# EAGLE design z0-probe-v8 (EAGLE 9.4.1)
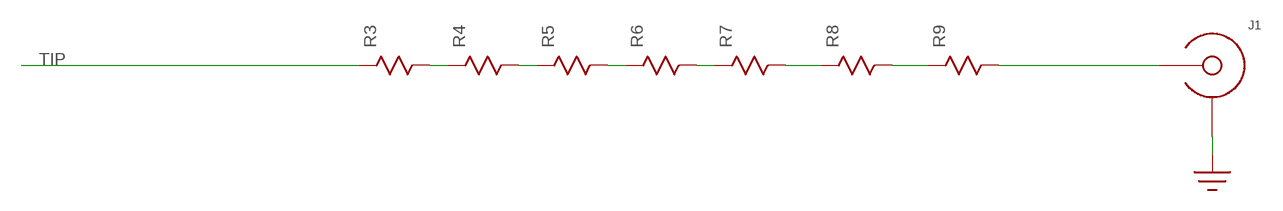
[diagram p0: schematic, sheet 1]

## Parts
J1  SMA-EDGE-LAUNCH  [SMA_EDGE_LAUNCH_2L_4020_TAPER_FIXED]
R3  R0603-TIGHT  [0603_TIGHT]
R4  R0603-TIGHT  [0603_TIGHT]
R5  R0603-TIGHT  [0603_TIGHT]
R6  R0603-TIGHT  [0603_TIGHT]
R7  R0603-TIGHT  [0603_TIGHT]
R8  R0603-TIGHT  [0603_TIGHT]
R9  R0603-TIGHT  [0603_TIGHT]

## Nets
GND: J1.BOTTOM_GND(SHIELD) J1.GND@1(SHIELD) J1.GND@2(SHIELD) J1.GND@3(SHIELD) J1.GND@4(SHIELD) J1.GND@5(SHIELD) J1.GND@6(SHIELD) J1.GND@7(SHIELD) J1.GND@8(SHIELD) J1.GND@14(SHIELD) J1.GND@15(SHIELD) J1.GND@16(SHIELD) J1.GND@17(SHIELD) J1.GND_PAD1(SHIELD) J1.GND_PAD2(SHIELD) J1.P$1(SHIELD) J1.P$2(SHIELD)
N$3: R3.P$2 R4.P$1
N$4: R4.P$2 R5.P$1
N$5: R5.P$2 R6.P$1
N$6: R6.P$2 R7.P$1
N$7: R7.P$2 R8.P$1
N$8: R8.P$2 R9.P$1
N$9 [50-ohm]: J1.CENTER@1(CENTER) J1.P$3(CENTER) R9.P$2
TIP: R3.P$1

## Library data of the parts
J1 = sma_footprint_2l:SMA-EDGE-LAUNCH
R3-R9 = yapo:R

## Net classes
1 50-ohm: width 0.775 mm, clearance 0.152 mm

## Board
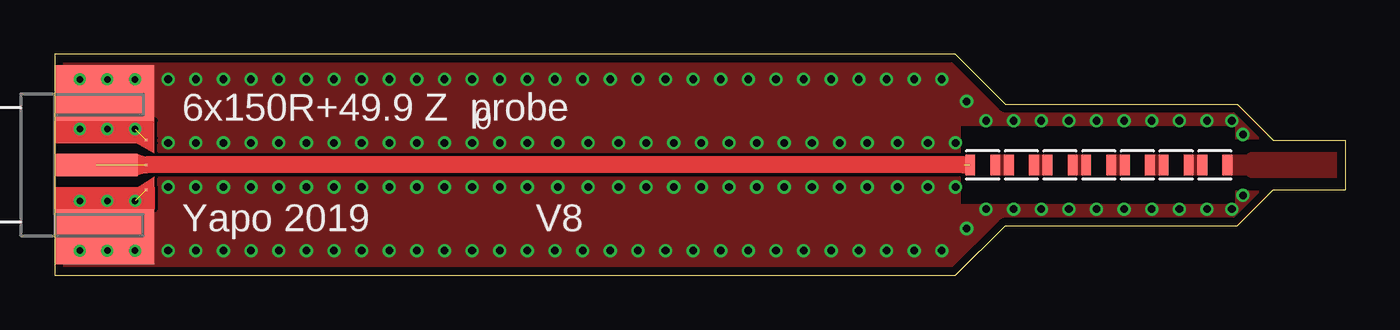
[diagram p1: board, top side]
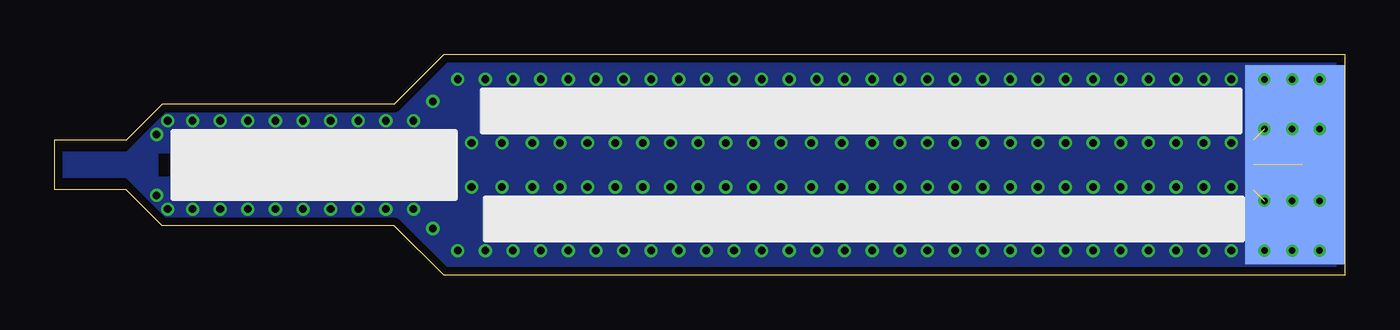
[diagram p2: board, bottom side, seen from below]

Size 59.31 x 10.16 mm. Coordinates in mm from the lower left corner, seen from the top.
Outline: 0,0 41.4,0 43.69,2.29 54.36,2.29 56.01,3.94 59.31,3.94 59.31,6.22 56.01,6.22 54.36,7.87 43.69,7.87 41.4,10.16 0,10.16 0,0
Copper layers (1*16): Top 0.035559375mm / dielectric 1.6mm / Bottom 0.035559375mm
Design rules "oshpark-2layer *": minimum track width 6mil, minimum drill 10mil, track to track 6mil, track to pad 6mil, pad to pad 6mil, via to via 6mil, smd to smd 6mil, copper to edge 15mil, drill to drill 6mil, minimum pad ring 5mil, minimum via ring 5mil, stop-mask expansion 2.5mil, vias tented up to drill 20mil, thermal gap 10mil

### Footprints (pad centres in the part's own frame; a part is rotated, then mirrored left to right if it is on the bottom)
SMA_EDGE_LAUNCH_2L_4020_TAPER_FIXED = smd 4.572 x 9.144 bottom: BOTTOM_GND 2.286,0 | smd 3.81 x 1.016: CENTER@1 1.905,0 | drill 0.3: GND@1 1.143,3.937; GND@2 3.683,3.937; GND@3 1.143,1.651; GND@4 3.683,1.651; GND@5 1.143,-1.651; GND@6 3.683,-1.651; GND@7 1.143,-3.937; GND@8 3.683,-3.937; GND@14 2.413,3.937; GND@15 2.413,-3.937; GND@16 2.413,-1.651; GND@17 2.413,1.651 | smd 4.572 x 2.54: GND_PAD1 2.286,3.302; GND_PAD2 2.286,-3.302 | smd 0.127 x 0.127: P$1 4.191,1.143; P$2 4.191,-1.143; P$3 4.191,0
0603_TIGHT = smd 0.45 x 0.95: P$1 -0.575,0; P$2 0.575,0

### Placement (x,y rotation side)
J1  0,5.08 0 top
R3  53.31,5.08 180 top
R4  51.54,5.08 180 top
R5  49.76,5.08 180 top
R6  47.98,5.08 180 top
R7  46.2,5.08 180 top
R8  44.42,5.08 180 top
R9  42.65,5.08 180 top

### Tracks (layer width: path | path; a pad name or v marks a point on that pad's centre or on a via)
GND  (via drill 0.35)  (2 unrouted)
  other vias: 42.8,7.11 44.07,7.11 45.34,7.11 46.61,7.11 47.88,7.11 49.15,7.11 50.42,7.11 51.69,7.11 52.96,7.11 54.1,7.11 42.8,3.05 44.07,3.05 45.34,3.05 46.61,3.05 47.88,3.05 49.15,3.05 50.42,3.05 51.69,3.05 52.96,3.05 54.1,3.05 41.91,8 41.91,2.16 54.61,6.48 54.61,3.68 11.56,6.1 12.83,6.1 14.1,6.1 15.37,6.1 16.64,6.1 17.91,6.1 19.18,6.1 20.45,6.1 21.72,6.1 23.11,6.1 24.51,6.1 25.91,6.1 38.73,6.1 40.13,6.1 11.56,4.06 12.83,4.06 14.1,4.06 15.37,4.06 16.64,4.06 17.91,4.06 19.18,4.06 20.45,4.06 21.72,4.06 23.11,4.06 24.51,4.06 25.91,4.06 38.73,4.06 40.13,4.06 11.56,9.02 12.83,9.02 14.1,9.02 15.37,9.02 16.64,9.02 17.91,9.02 19.18,9.02 20.45,9.02 21.72,9.02 22.99,9.02 24.26,9.02 25.53,9.02 26.8,9.02 39.5,9.02 40.77,9.02 11.56,1.14 12.83,1.14 14.1,1.14 15.37,1.14 16.64,1.14 17.91,1.14 19.18,1.14 20.45,1.14 21.72,1.14 22.99,1.14 24.26,1.14 25.53,1.14 26.8,1.14 39.5,1.14 40.77,1.14 5.21,6.1 6.48,6.1 7.75,6.1 9.02,6.1 10.29,6.1 5.21,9.02 6.48,9.02 7.75,9.02 9.02,9.02 10.29,9.02 5.21,1.14 6.48,1.14 7.75,1.14 9.02,1.14 10.29,1.14 5.21,4.06 6.48,4.06 7.75,4.06 9.02,4.06 10.29,4.06 41.4,6.1 41.4,4.06 28.07,9.02 29.34,9.02 30.61,9.02 31.88,9.02 33.15,9.02 34.42,9.02 35.69,9.02 36.96,9.02 38.23,9.02 27.18,6.1 28.45,6.1 29.72,6.1 30.99,6.1 32.26,6.1 33.53,6.1 34.8,6.1 36.07,6.1 37.34,6.1 27.18,4.06 28.45,4.06 29.72,4.06 30.99,4.06 32.26,4.06 33.53,4.06 34.8,4.06 36.07,4.06 37.34,4.06 28.07,1.14 29.34,1.14 30.61,1.14 31.88,1.14 33.15,1.14 34.42,1.14 35.69,1.14 36.96,1.14 38.23,1.14
  pour Top (isolate 0.152, rank 2, no thermals): 0,10.16 59.31,10.16 59.31,0 0,0
  pour Bottom: 0,0 59.31,0 59.31,10.16 0,10.16
  cutout Top: 41.66,6.83 41.66,5.61 54.23,5.61 54.23,6.83
  cutout Top: 54.23,5.71 59.31,5.71 59.31,6.22 54.23,6.22
  cutout Top: 54.23,4.45 54.23,3.94 59.31,3.94 59.31,4.45
  cutout Top: 41.66,4.55 41.66,3.33 54.23,3.33 54.23,4.55
  cutout Bottom: 54.48,5.59 41.78,5.59 41.78,4.57 54.48,4.57
  cutout Bottom: 55.5,6.22 56.01,5.71 59.31,5.71 59.31,6.22
  cutout Bottom: 55.5,3.94 56.01,4.45 59.31,4.45 59.31,3.94
N$3
  pour Top (no thermals): 52.04,4.67 52.65,4.67 52.65,5.49 52.04,5.49
N$4
  pour Top (no thermals): 50.27,4.67 50.88,4.67 50.88,5.49 50.27,5.49
N$5
  pour Top (no thermals): 48.54,4.67 49.2,4.67 49.2,5.49 48.54,5.49
N$6
  pour Top (no thermals): 46.76,4.67 47.32,4.67 47.32,5.49 46.76,5.49
N$7
  pour Top (no thermals): 44.93,4.67 45.57,4.67 45.57,5.49 44.93,5.49
N$8
  pour Top (no thermals): 43.26,4.67 43.81,4.67 43.81,5.49 43.26,5.49
N$9  (2 unrouted)
  Top 0.775: 41.78,5.08 J1.P$3
TIP
  pour Top (no thermals): 53.98,5.49 53.98,4.67 54.82,4.67 54.99,4.57 59.31,4.57 59.31,5.59 54.99,5.59 54.82,5.49

### Text on the board
tPlace: 6x150R+49.9 Z probe | 0 | Yapo 2019 | V8